# EAGLE design esp32stepdown (EAGLE 9.6.2)
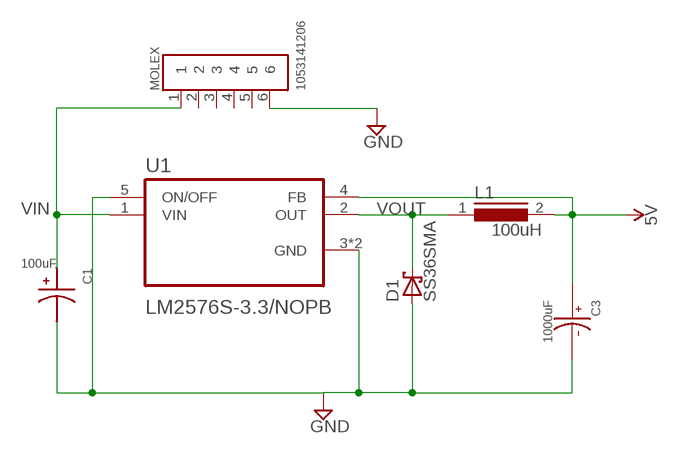
[diagram p0: schematic, sheet 1]

## Parts
C1  100uF  ECA1JM101  [CAPPRD350W60D850H1250]
C3  1000uF  ECA-1EM102  [CAPPRD500W60D1000H2000B]
D1  SS36SMA  [SMA]
L1  100uH  DR73  [DR73]
MOLEX  1053141206  [MOLEX_1053141206]
U1  LM2576S-3.3/NOPB  [VREG_TPS79625KTTR]

## Nets
GND: MOLEX.6
VIN: C1.1 MOLEX.1 U1.1(VIN)
VOUT: C1.2 C3.+ C3.- D1.A D1.C L1.1 L1.2 U1.2(OUT) U1.3(GND) U1.4(FB) U1.5(ON/OFF) U1.6(GND) ; supply symbol labelled 5V, GND
Unconnected: MOLEX.2 MOLEX.3 MOLEX.4 MOLEX.5

## Library data of the parts
C1 = ECA1JM101:ECA1JM101: 100µF 50V Aluminum Electrolytic Capacitors Radial, Can 2000 Hrs @ 85°C Check prices <https://pricing.snapeda.com/search/part/ECA-1JM101/?ref=eda>; AVAILABILITY: Warning; DESCRIPTION: 100µF 63V Aluminum Electrolytic Capacitors Radial, Can 2000 Hrs @ 85°C; MF: Panasonic; MP: ECA-1JM101; PACKAGE: Radial Panasonic; PRICE: None; PURCHASE-URL: https://pricing.snapeda.com/search/part/ECA-1JM101/?ref=eda
C3 = ECA-1EM102:ECA-1EM102: Cap Aluminum 1000uF 25V 20% (10 X 20mm) Radial Aluminum Cylindrical Can 5mm 850mA 2000 hr 85°C Bulk Check prices <https://pricing.snapeda.com/search/part/ECA-1EM102/?ref=eda>; AVAILABILITY: Good; DESCRIPTION: 1000µF 25V Aluminum Electrolytic Capacitors Radial, Can 2000 Hrs @ 85°C; MF: Panasonic; MP: ECA-1EM102; PACKAGE: Radial Panasonic; PRICE: None; PURCHASE-URL: https://pricing.snapeda.com/search/part/ECA-1EM102/?ref=eda
D1 = SS36:SS36: 3A 60V Schottky diode Check prices <https://pricing.snapeda.com/search/part/SS36/?ref=eda>; AVAILABILITY: Good; DESCRIPTION: Diode Schottky 60V 3A Surface Mount SMC (DO-214AB); MF: ON Semiconductor; MP: SS36; PACKAGE: SMC-2 ON Semiconductor; PRICE: None; PURCHASE-URL: https://pricing.snapeda.com/search/part/SS36/?ref=eda
L1 = inductors:DR73: High Power Density, High Efficiency, Shielded Inductors Source: coiltronics_dr_series.pdf; SPICEPREFIX: L
MOLEX = 1053141206:1053141206: Nano-Fit Right Angle Header; Through Hole; 2.50mm; Dual Row; 6 Circuit; Gold Plating Check prices <https://pricing.snapeda.com/search/part/1053141206/?ref=eda>; AVAILABILITY: Good; DESCRIPTION: Connector Header Through Hole, Right Angle 6 position 0.098 (2.50mm); MF: Molex; MP: 1053141206; PACKAGE: 1206 Molex; PRICE: None; PURCHASE-URL: https://pricing.snapeda.com/search/part/1053141206/?ref=eda
U1 = LM2576S-3.3_NOPB:LM2576S-3.3/NOPB: Check prices <https://pricing.snapeda.com/search/part/LM2576S-3.3/NOPB/?ref=eda>; AVAILABILITY: Warning; DESCRIPTION: SIMPLE SWITCHER&reg; 40V, 3A Low Component Count Step-Down Regulator 5-DDPAK/TO-263 -40 to 125; MF: Texas Instruments; MP: LM2576S-3.3/NOPB; PACKAGE: TO-263-5 Texas Instruments; PRICE: None; PURCHASE-URL: https://pricing.snapeda.com/search/part/LM2576S-3.3/NOPB/?ref=eda

## Board
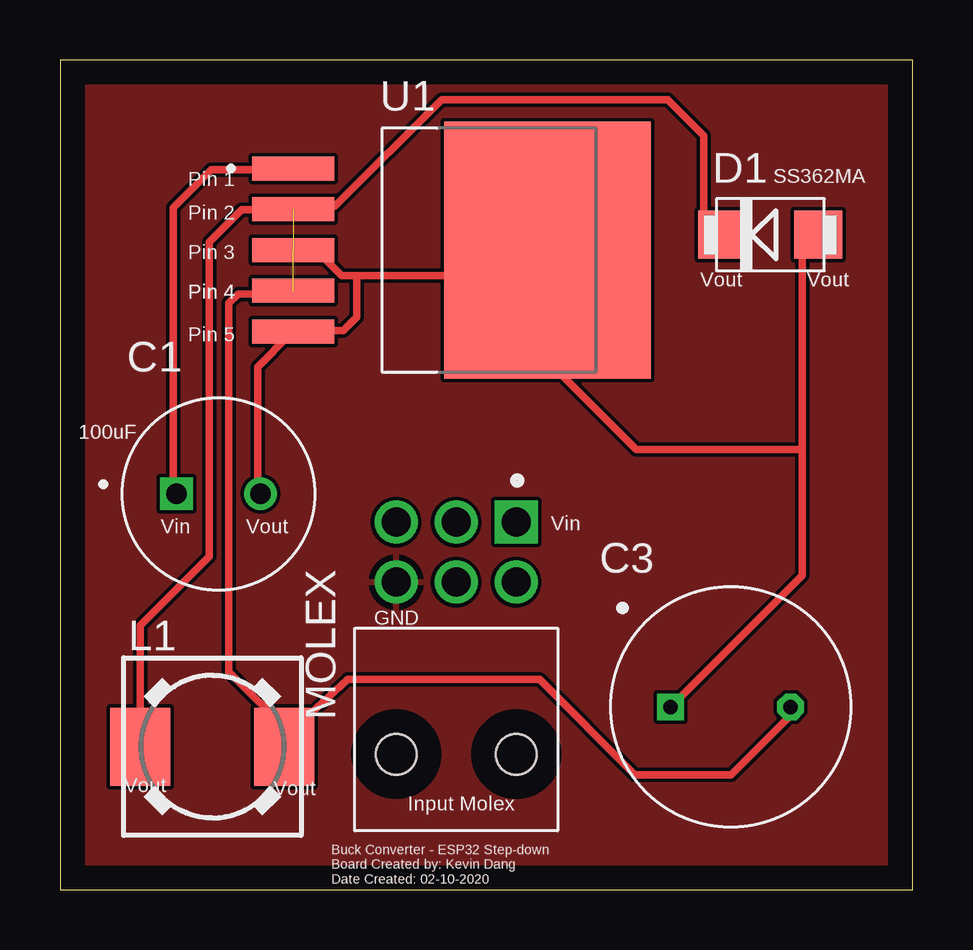
[diagram p1: board, top side]
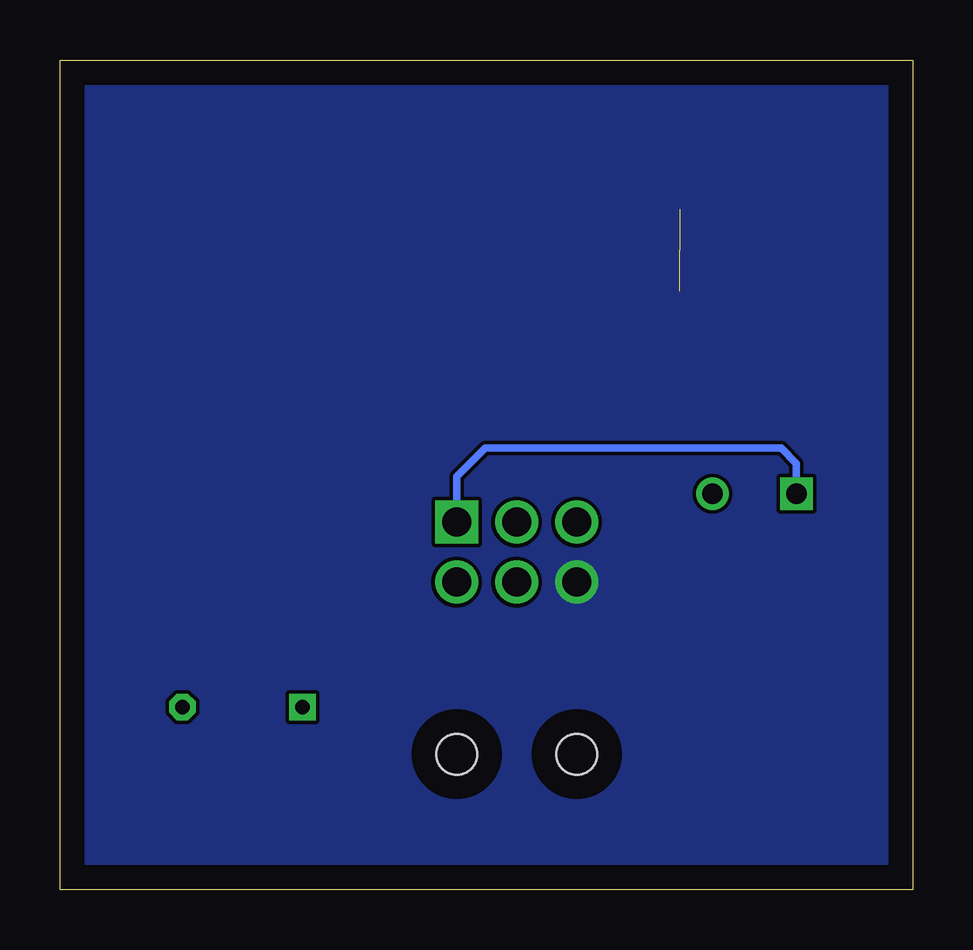
[diagram p2: board, bottom side, seen from below]

Size 35.54 x 34.59 mm. Coordinates in mm from the lower left corner, seen from the top.
Outline: 0,0 35.54,0 35.54,34.59 0,34.59 0,0
Copper layers (1*16): Top 0.035mm / dielectric 1.5mm / Bottom 0.035mm
Design rules "default": minimum track width 6mil, minimum drill 0.35mm, track to track 6mil, track to pad 6mil, pad to pad 6mil, via to via 6mil, smd to smd 6mil, copper to edge 40mil, drill to drill 6mil, minimum pad ring 10mil, minimum via ring 8mil, stop-mask expansion 4mil, vias tented up to drill 0mil, thermal gap 10mil

### Footprints (pad centres in the part's own frame; a part is rotated, then mirrored left to right if it is on the bottom)
CAPPRD350W60D850H1250 = drill 0.85 pad 1.28 square: 1 -1.75,0 | drill 0.85 pad 1.28: 2 1.75,0
CAPPRD500W60D1000H2000B = drill 0.6 octagon: + 2.5,0 | drill 0.6 square: - -2.5,0
SMA = smd 2 x 2: A 1.75,0; C -2.25,0
DR73 = smd 2.5 x 3.25: 1 -3,0; 2 3,0
MOLEX_1053141206 = drill 1.2 square: 1 2.5,6.44 | drill 1.2: 2 0,6.44; 3 -2.5,6.44; 4 2.5,3.94; 5 0,3.94; 6 -2.5,3.94 | hole 1.7: 2.5,-3.24; -2.5,-3.24
VREG_TPS79625KTTR = smd 3.4 x 1: 1 -10.6,3.4; 2 -10.6,1.7; 3 -10.6,0; 4 -10.6,-1.7; 5 -10.6,-3.4 | smd 8.6 x 10.7: 6 0,0

### Placement (x,y rotation side)
C1  6.6,16.51 0 top
C3  27.94,7.62 0 top
D1  29.84,27.3 0 top
L1  6.35,5.97 0 top
MOLEX  16.51,8.89 0 top
U1  20.32,26.67 0 top

### Tracks (layer width: path | path; a pad name or v marks a point on that pad's centre or on a via)
GND
  pour Top: -0.64,35.31 36.07,35.31 36.07,-0.51 35.81,-0.76 -0.64,-0.76
  pour Bottom (no thermals): -1.65,36.2 37.21,36.2 37.21,-1.4 -1.65,-1.4
VIN
  Top 0.152: 4.72,16.62 C1.1
  Top 0.305: 4.72,16.62 4.72,28.45 6.3,30.02 9.6,30.02 U1.1
  Bottom 0.305: MOLEX.1 19.01,17.23 17.83,18.41 5.49,18.41 4.85,17.78 C1.1
VOUT  (2 unrouted)
  Top 0.152: 9.45,6.4 9.59,6.54 | 3.35,6.02 L1.1 | 25.45,7.62 C3.- | 8.23,16.61 C1.2 | 20.27,26.67 19.2,25.6 U1.6 20.27,26.67
  Top 0.305: C3.+ 30.44,7.28 27.96,4.8 23.95,4.8 19.99,8.76 11.99,8.76 9.91,6.86 9.59,6.54 7.04,9.09 7.04,24.46 7.42,24.84 9.6,24.84 U1.4 | L1.2 9.61,6.23 9.45,6.4 | D1.C 26.82,27.59 26.82,31.45 25.32,32.94 15.9,32.94 11.46,28.5 9.75,28.5 U1.2 9.6,28.35 7.57,28.35 6.22,27 6.22,13.89 3.35,11.02 3.35,6.02 | 30.94,18.36 30.94,13.11 25.45,7.62 | D1.A 30.94,26.65 30.94,18.36 | 8.23,16.61 8.23,21.79 9.6,23.16 U1.5 9.75,23.32 11.81,23.32 12.37,23.88 12.37,25.6 | U1.3 10.67,26.67 11.73,25.6 12.37,25.6 | 12.37,25.6 19.2,25.6 19.2,23.16 24,18.36 30.94,18.36

### Text on the board
tPlace: Pin 1 | SS362MA | Pin 2 | Pin 3 | Pin 4 | Pin 4 | Vout | Vout | Pin 5 | 100uF | Vin | Vout | Vin | GND | Vout | Vout | Input Molex | Buck Converter - ESP32 Step-down / Board Created by: Kevin Dang / Date Created: 02-10-2020